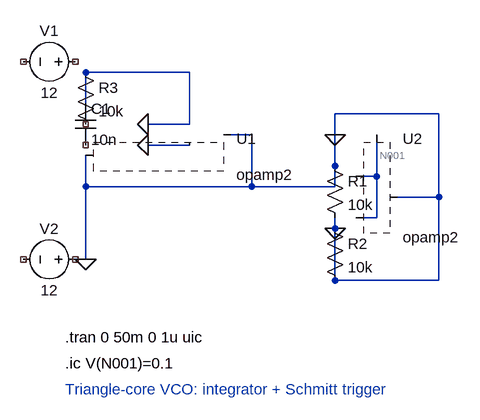
[diagram p0: schematic triangle-core-vco.asc]
triangle-core-vco.asc, the LTspice schematic file:
Version 4
SHEET 1 1200 800
WIRE 160 160 160 112
WIRE 160 288 160 240
WIRE 320 192 256 192
WIRE 320 224 256 224
WIRE 160 112 320 112
WIRE 320 112 320 192
WIRE 416 208 384 208
WIRE 416 208 416 288
WIRE 160 288 416 288
WIRE 544 256 544 208
WIRE 544 352 544 336
WIRE 608 272 608 208
WIRE 608 272 576 272
WIRE 608 336 576 336
WIRE 608 336 608 272
WIRE 416 288 544 288
WIRE 544 288 544 256
WIRE 704 304 640 304
WIRE 704 304 704 176
WIRE 704 176 544 176
WIRE 544 176 544 208
WIRE 704 304 704 432
WIRE 704 432 544 432
WIRE 544 432 544 352
WIRE 160 400 160 288
FLAG 160 400 0
FLAG 256 192 0
FLAG 256 224 0
FLAG 544 208 0
FLAG 544 352 0
SYMBOL opamp2 352 208 R0
SYMATTR InstName U1
SYMATTR Value2 Avol=100K GBW=3Meg Slew=13Meg
SYMBOL opamp2 608 304 R0
SYMATTR InstName U2
SYMATTR Value2 Avol=100K GBW=3Meg Slew=13Meg
SYMBOL cap 144 160 R0
SYMATTR InstName C1
SYMATTR Value 10n
SYMBOL res 528 240 R0
SYMATTR InstName R1
SYMATTR Value 10k
SYMBOL res 528 336 R0
SYMATTR InstName R2
SYMATTR Value 10k
SYMBOL res 144 96 R0
SYMATTR InstName R3
SYMATTR Value 10k
SYMBOL voltage 160 96 R90
WINDOW 0 -32 56 VBottom 2
WINDOW 3 32 56 VTop 2
SYMATTR InstName V1
SYMATTR Value 12
SYMBOL voltage 160 400 R90
WINDOW 0 -32 56 VBottom 2
WINDOW 3 32 56 VTop 2
SYMATTR InstName V2
SYMATTR Value 12
TEXT 128 520 Left 2 !.tran 0 50m 0 1u uic
TEXT 128 560 Left 2 !.ic V(N001)=0.1
TEXT 128 600 Left 2 ;Triangle-core VCO: integrator + Schmitt trigger

The netlist it stands for:
* triangle-core-vco.asc
* U1: Avol=100K GBW=3Meg Slew=13Meg (symbol opamp2 not available, pin order unknown); nets seen at it: 0
* U2: Avol=100K GBW=3Meg Slew=13Meg (symbol opamp2 not available, pin order unknown); nets seen at it: 0, N001
C1 0 NC_01 10n
R1 0 0 10k
R2 0 0 10k
R3 0 NC_02 10k
V1 NC_03 NC_04 12
V2 NC_05 NC_06 12
.tran 0 50m 0 1u uic
.ic V(N001)=0.1
* Triangle-core VCO: integrator + Schmitt trigger
.backanno
.end